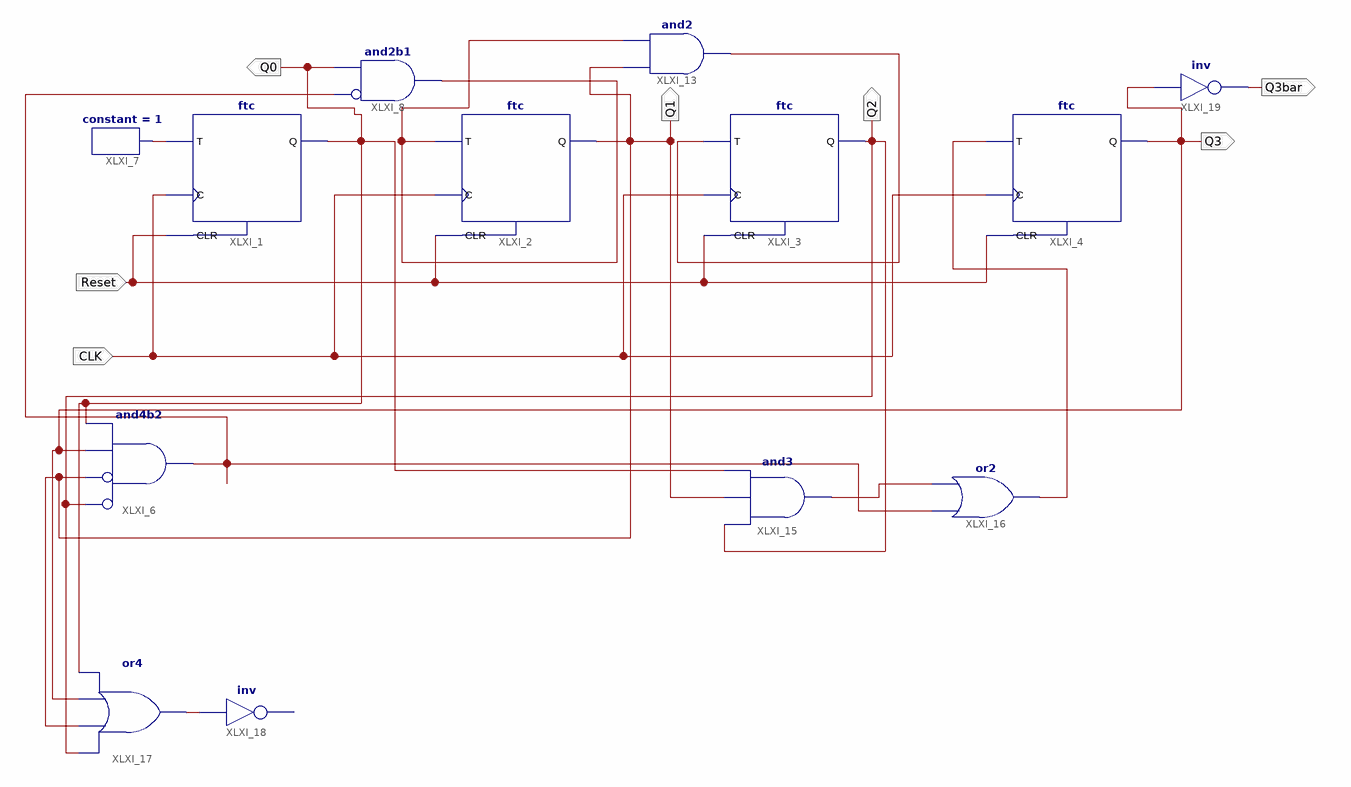
[diagram p0: schematic sheet 1]
// Xilinx ISE schematic modulo10.sch (spartan6) as structural Verilog: 13 symbols, 7 ports
module modulo10 (
  input  Reset,
  input  CLK,
  output Q2,
  output Q3,
  output Q0,
  output Q1,
  output Q3bar
);

  wire EoC10, XLXN_10, XLXN_15, XLXN_19, XLXN_20, XLXN_21, XLXN_23;

  ftc XLXI_1 (.C(CLK), .CLR(Reset), .T(XLXN_10), .Q(Q0));
  ftc XLXI_2 (.C(CLK), .CLR(Reset), .T(XLXN_15), .Q(Q1));
  ftc XLXI_3 (.C(CLK), .CLR(Reset), .T(XLXN_19), .Q(Q2));
  ftc XLXI_4 (.C(CLK), .CLR(Reset), .T(XLXN_21), .Q(Q3));
  and XLXI_6 (EoC10, ~Q2, ~Q1, Q3, Q0);  // and4b2
  constant #(.CValue("1")) XLXI_7 (.O(XLXN_10));
  and XLXI_8 (XLXN_15, ~EoC10, Q0);  // and2b1
  and XLXI_13 (XLXN_19, Q1, XLXN_15);
  and XLXI_15 (XLXN_20, Q2, Q1, Q0);
  or XLXI_16 (XLXN_21, EoC10, XLXN_20);
  or XLXI_17 (XLXN_23, Q2, Q1, Q3, Q0);
  // inv XLXI_18 has open pins: I=XLXN_23, O=open
  not XLXI_19 (Q3bar, Q3);
endmodule
